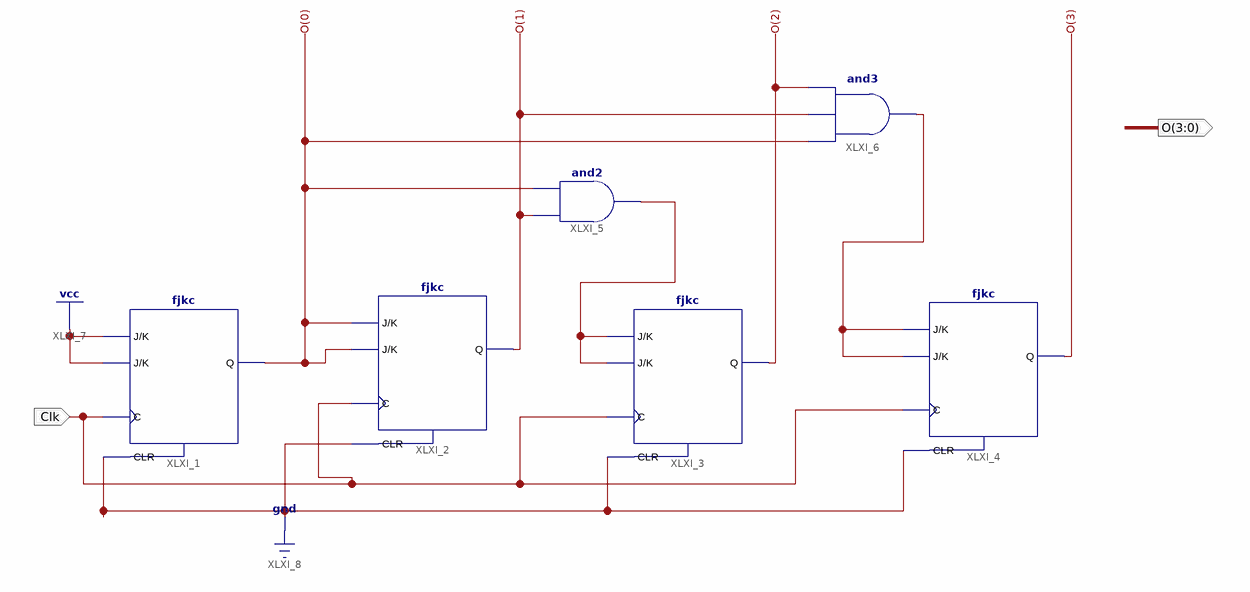
[diagram p0: schematic sheet 1]
// Xilinx ISE schematic Counter0_15.sch (spartan6) as structural Verilog: 6 symbols, 2 ports
module Counter0_15 (
  input  Clk,
  output [3:0] O
);

  wire XLXN_12, XLXN_15;

  fjkc XLXI_1 (.C(Clk), .CLR(1'b0), .J(1'b1), .K(1'b1), .Q(O[0]));
  fjkc XLXI_2 (.C(Clk), .CLR(1'b0), .J(O[0]), .K(O[0]), .Q(O[1]));
  fjkc XLXI_3 (.C(Clk), .CLR(1'b0), .J(XLXN_12), .K(XLXN_12), .Q(O[2]));
  fjkc XLXI_4 (.C(Clk), .CLR(1'b0), .J(XLXN_15), .K(XLXN_15), .Q(O[3]));
  and XLXI_5 (XLXN_12, O[1], O[0]);
  and XLXI_6 (XLXN_15, O[0], O[1], O[2]);
endmodule
